# Altium project ESP32_DevBoard_B.PrjPcb
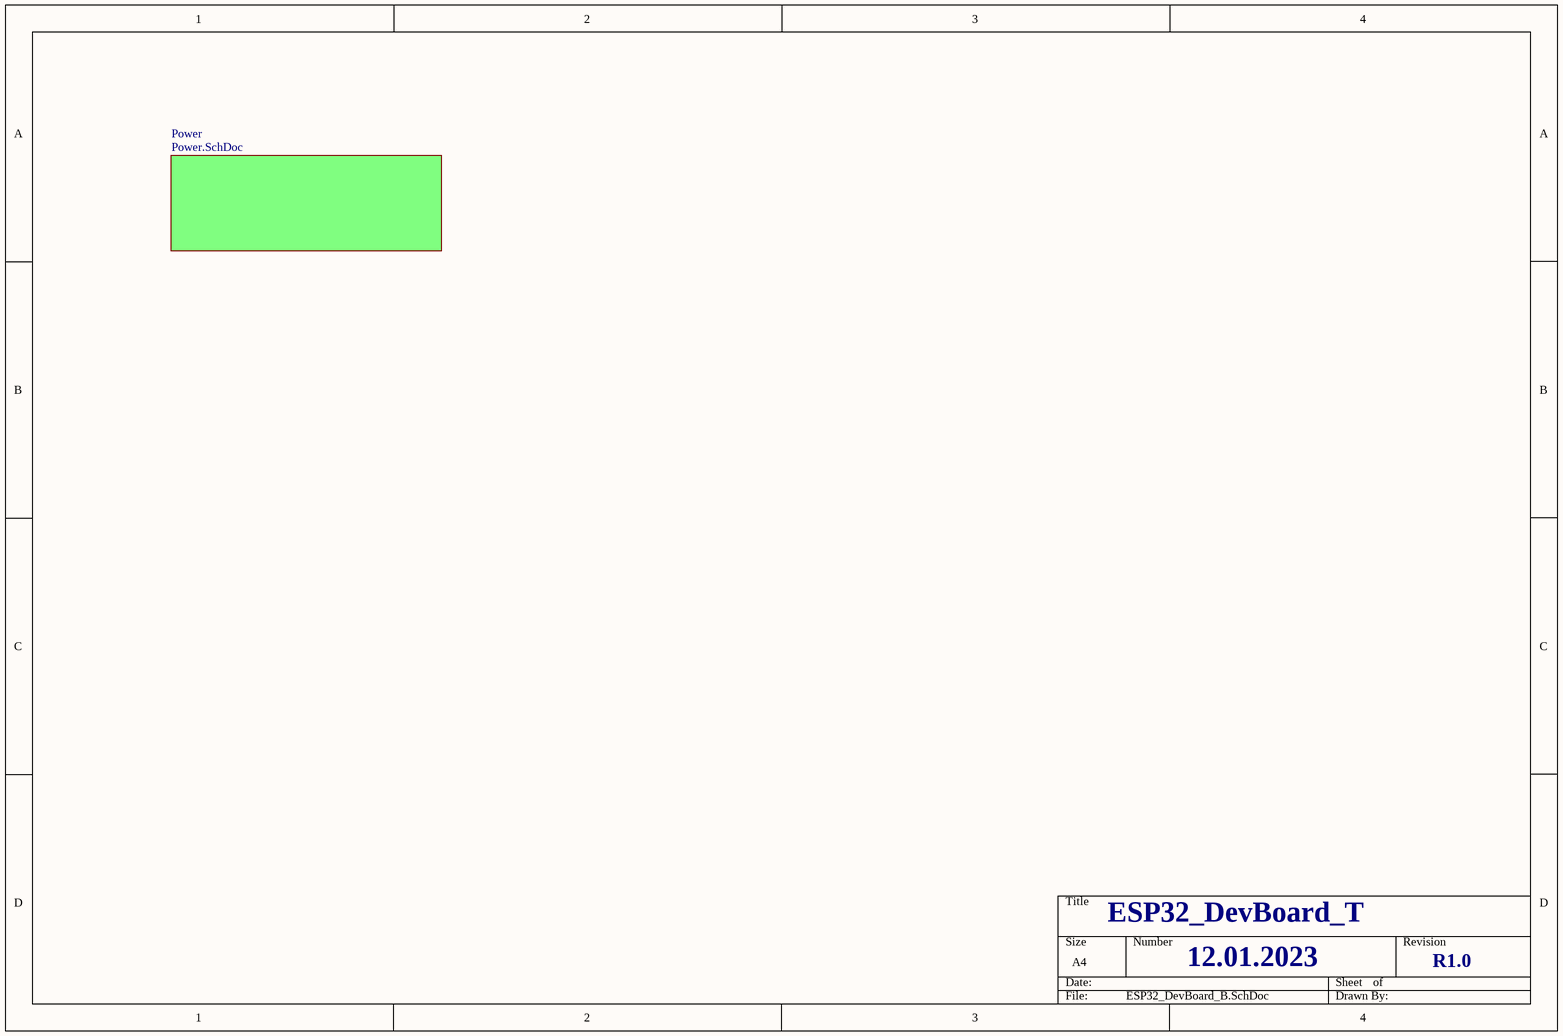
[diagram p0: ESP32_DevBoard_B.SchDoc]
5 sheets, 33 parts. Net scope: flat (ports and power ports of the same name join across sheets).
Board file: ESP32_DevBoard_B.PcbDoc
Sheets:
  ESP32_DevBoard_B.SchDoc
    Power = Power.SchDoc
  Output_Digital.SchDoc
  Connector.SchDoc
  Input_Digital.SchDoc

## Sheet ESP32_DevBoard_B.SchDoc
size A4

### Sub-sheets
Power = Power.SchDoc: no entries

### Notes on the sheet
- ESP32_DevBoard_T
- 12.01.2023
- R1.0

## Sheet Power.SchDoc
size A4
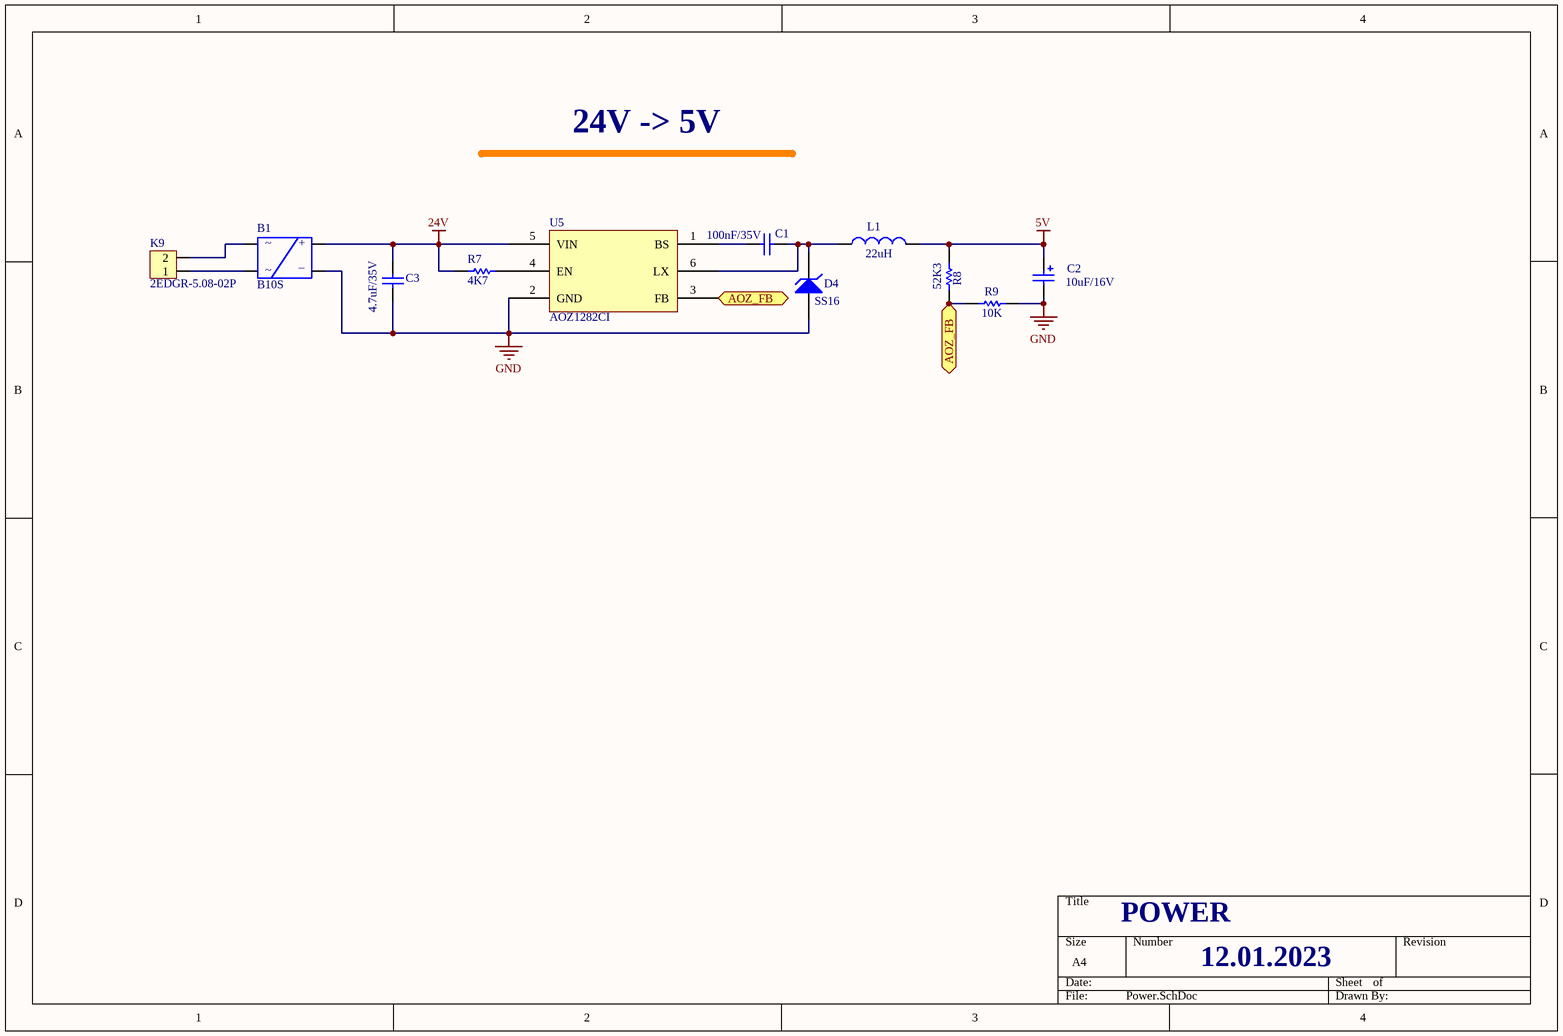
[diagram p1: Power.SchDoc]

### Parts
B1  B10S  [B10S]
C1  100nF/35V  [CAP0603W]
C2  10uF/16V  [CAP A]
C3  4.7uF/35V  [CAP1206W]
D4  SS16  [DO214AC]
K9  2EDGR-5.08-02P  [CON_DG129_02P]
L1  22uH  [INDUCTOR C43]
R7  4K7  [RES1608[0603]]
R8  52K3  [RES1608[0603]]
R9  10K  [RES1608[0603]]
U5  AOZ1282CI  [SOT23-6]

### Ports
AOZ_FB

### Nets
5V: C2.1 L1.2 R8.1
24V: B1.3 C3.1 R7.2 U5.5(VIN)
GND: B1.4 C2.2 C3.2 D4.1(A) R9.1 U5.2(GND)
NetB1_1: B1.1 K9.2
NetB1_2: B1.2 K9.1
NetC1_1: C1.1 U5.1(BS)
NetC1_2: C1.2 D4.2(K) L1.1 U5.6(LX)
NetR7_1: R7.1 U5.4(EN)
NetR8_2: R8.2 R9.2 U5.3(FB) ; port AOZ_FB

### Notes on the sheet
- 24V -> 5V
- POWER
- 12.01.2023
- (in symbol BRIDGE RECTIFIER) ~; +; _

### Library data of the parts
B1 = BRIDGE RECTIFIER: DIODE B10S MIC SMD; RB156: RB156
C1 = CAP1: CAPACITOR 0603 Case; Value: 100nF; Published: 8-Jun-2000; LatestRevisionDate: 17-Jul-2002; LatestRevisionNote: Re-released for DXP Platform.; PackageReference: C1206; Publisher: Altium Limited
C2 = CAP2: CAPACITOR Polarized Capacitor; Value: 100uF; Published: 8-Jun-2000; LatestRevisionDate: 17-Jul-2002; LatestRevisionNote: Re-released for DXP Platform.; PackageReference: RB7.6-15; Publisher: Altium Limited
C3 = CAP1: CAPACITOR 1206Case; Value: 100nF; Published: 8-Jun-2000; LatestRevisionDate: 17-Jul-2002; LatestRevisionNote: Re-released for DXP Platform.; PackageReference: C1206; Publisher: Altium Limited
D4 = DIODE: DIODE SCHOTTKY SS16 1A 60V DO214AC SMA; Published: 8-Jun-2000; LatestRevisionDate: 17-Jul-2002; LatestRevisionNote: Re-released for DXP Platform.; PackageReference: DIODE-0.7; Publisher: Altium Limited
K9 = KLEMENS_2P: CONNECTOR 5.08mm 2PIN 90DEG
L1 = INDUCTOR: INDUCTOR 22uH SDR43-220M-LF SMD 4.5X4X3.2MM; Code_IEC: 1005; Published: 8-Jun-2000; LatestRevisionDate: 17-Jul-2002; LatestRevisionNote: Re-released for DXP Platform.; PackageReference: 0402-A; Publisher: Altium Limited; Code_JEITA: 0402
R7-R9 = RES: RESISTOR 0603 Case %1; Value: 430R; Published: 8-Jun-2000; LatestRevisionDate: 17-Jul-2002; LatestRevisionNote: Re-released for DXP Platform.; PackageReference: AXIAL-0.5; Publisher: Altium Limited
U5 = AOZ1282CI: REGULATOR IC-1282 REG BUCK ADJ 1.2A SOT23-6

## Sheet Output_Digital.SchDoc
size A4
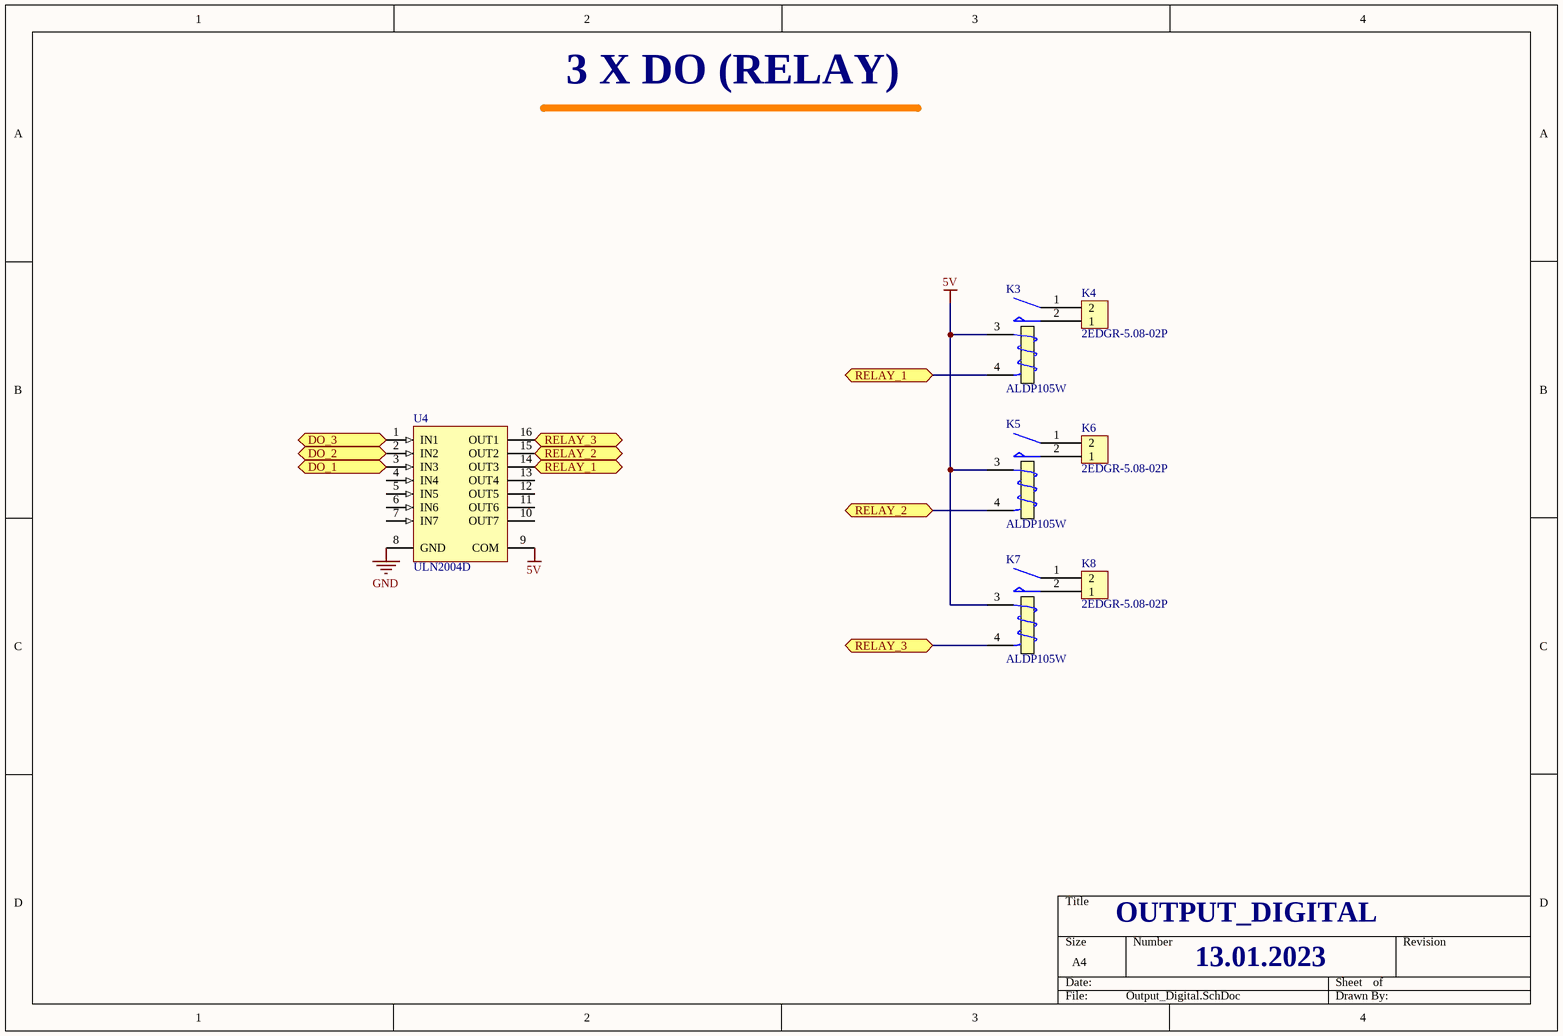
[diagram p2: Output_Digital.SchDoc]

### Parts
K3  ALDP105W  [RELAY_ALDP124W]
K4  2EDGR-5.08-02P  [CON_DG129_02P]
K5  ALDP105W  [RELAY_ALDP124W]
K6  2EDGR-5.08-02P  [CON_DG129_02P]
K7  ALDP105W  [RELAY_ALDP124W]
K8  2EDGR-5.08-02P  [CON_DG129_02P]
U4  ULN2004D  [SO16_M]

### Ports
DO_1, DO_2, DO_3, RELAY_1, RELAY_2, RELAY_3

### Nets
5V: K3.3(T1) K5.3(T1) K7.3(T1) U4.9(COM)
GND: U4.8(GND)
NetK3_1: K3.1(COM) K4.2
NetK3_2: K3.2(NO) K4.1
NetK3_4: K3.4(T2) U4.14(OUT3) ; port RELAY_1
NetK5_1: K5.1(COM) K6.2
NetK5_2: K5.2(NO) K6.1
NetK5_4: K5.4(T2) U4.15(OUT2) ; port RELAY_2
NetK7_1: K7.1(COM) K8.2
NetK7_2: K7.2(NO) K8.1
NetK7_4: K7.4(T2) U4.16(OUT1) ; port RELAY_3
NetP1_7: U4.2(IN2) ; port DO_2
NetP1_8: U4.3(IN3) ; port DO_1
NetP1_10: U4.1(IN1) ; port DO_3

Not connected (* = marked no-connect by the designer): U4 4(IN4) 5(IN5) 6(IN6) 7(IN7) 10(OUT7) 11(OUT6) 12(OUT5) 13(OUT4)

### Notes on the sheet
- 3 X DO (RELAY)
- OUTPUT_DIGITAL
- 13.01.2023

### Library data of the parts
K3 K5 K7 = RELAY_ALDP124W: RELAY PANASONIC ALDP105W 5A; Published: 8-Jun-2000; LatestRevisionDate: 17-Jul-2002; LatestRevisionNote: Re-released for DXP Platform.; PackageReference: MODULE5B; Publisher: Altium Limited
K4 K6 K8 = KLEMENS_2P: CONNECTOR 5.08mm 2PIN 90DEG
U4 = ULN2004D: IC Seven Darlington Array Integrated suppression diodes for inductive  loads; Published: 8-Jun-2000; LatestRevisionDate: 13-Apr-2006; LatestRevisionNote: IPC-7351 Footprint Added.; DatasheetVersion: Sep-1998; PackageVersion: May-1998; PackageReference: SO16; Publisher: Altium Limited; PackageDescription: 16-Pin Small Outline Integrated Circuit 1.27 mm Pitch; Code_IPC: SOIC127P600-16; ComponentLink1Description: Manufacturer Link; ComponentLink1URL: http://www.st.com/; ComponentLink2Description: Datasheet; ComponentLink2URL: http://www.st.com/stonline/products/literature/ds/5279/uln2001.pdf

## Sheet Connector.SchDoc
size A4
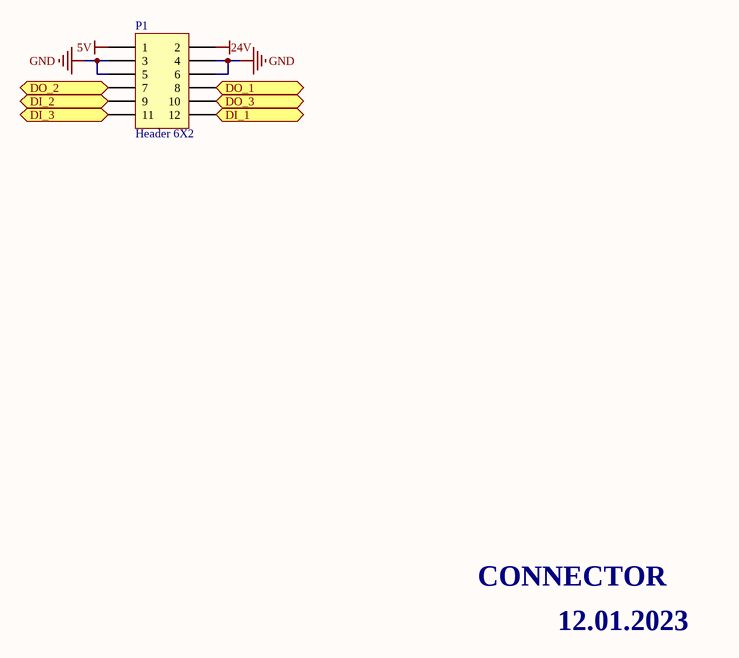
[diagram p3: Connector.SchDoc]

### Parts
P1  Header 6X2  [HDR2X6]

### Ports
DI_1, DI_2, DI_3, DO_1, DO_2, DO_3

### Nets
5V: P1.1
24V: P1.2
GND: P1.3 P1.4 P1.5 P1.6
NetP1_7: P1.7 ; port DO_2
NetP1_8: P1.8 ; port DO_1
NetP1_9: P1.9 ; port DI_2
NetP1_10: P1.10 ; port DO_3
NetP1_11: P1.11 ; port DI_3
NetP1_12: P1.12 ; port DI_1

### Notes on the sheet
- CONNECTOR
- 12.01.2023

### Library data of the parts
P1 = Header 6X2: CONNECTOR Header, 6-Pin, Dual row; LatestRevisionDate: 17-Jul-2002; LatestRevisionNote: Re-released for DXP Platform.; Publisher: Altium Limited

## Sheet Input_Digital.SchDoc
size A4
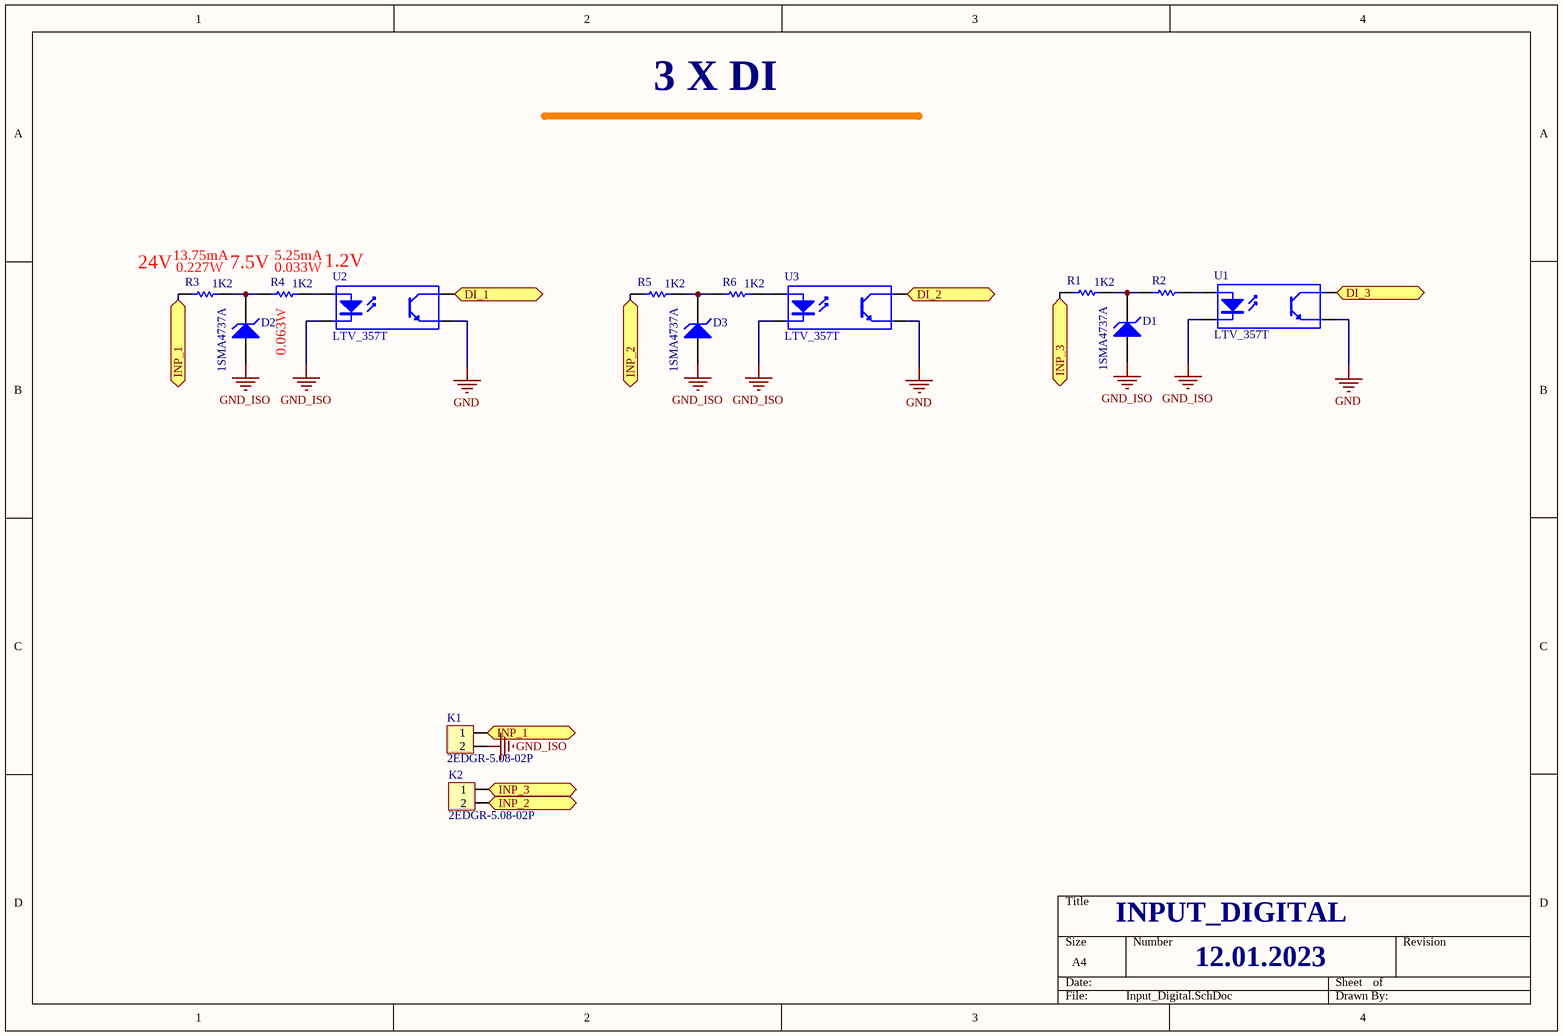
[diagram p4: Input_Digital.SchDoc]

### Parts
D1  1SMA4737A  [DO214AC]
D2  1SMA4737A  [DO214AC]
D3  1SMA4737A  [DO214AC]
K1  2EDGR-5.08-02P  [CON_DG129_02P]
K2  2EDGR-5.08-02P  [CON_DG129_02P]
R1  1K2  [RES3216[1206]]
R2  1K2  [RES2012[0805]]  (value not drawn)
R3  1K2  [RES3216[1206]]
R4  1K2  [RES2012[0805]]
R5  1K2  [RES3216[1206]]
R6  1K2  [RES2012[0805]]
U1  LTV_357T  [SMD-4]
U2  LTV_357T  [SMD-4]
U3  LTV_357T  [SMD-4]

### Ports
DI_1, DI_2, DI_3, INP_1, INP_2, INP_3

### Nets
GND: U1.3(E) U2.3(E) U3.3(E)
GND_ISO: D1.1(A) D2.1(A) D3.1(A) K1.2 U1.2(K) U2.2(K) U3.2(K)
NetD1_2: D1.2(K) R1.1 R2.2
NetD2_2: D2.2(K) R3.1 R4.2
NetD3_2: D3.2(K) R5.1 R6.2
NetK1_1: K1.1 R3.2 ; port INP_1
NetK2_1: K2.1 R1.2 ; port INP_3
NetK2_2: K2.2 R5.2 ; port INP_2
NetP1_9: U3.4(C) ; port DI_2
NetP1_11: U1.4(C) ; port DI_3
NetP1_12: U2.4(C) ; port DI_1
NetR2_1: R2.1 U1.1(A)
NetR4_1: R4.1 U2.1(A)
NetR6_1: R6.1 U3.1(A)

### Notes on the sheet
- 3 X DI
- (near R3) 24V
- (near R3) 13.75mA
- (near R3) 0.227W
- 7.5V
- 5.25mA
- 0.033W
- 1.2V
- 0.063W
- INPUT_DIGITAL
- 12.01.2023

### Library data of the parts
D1-D3 = DIODE: DIODE Zener Diode 7.5V 1W DO214AC; Published: 8-Jun-2000; LatestRevisionDate: 17-Jul-2002; LatestRevisionNote: Re-released for DXP Platform.; PackageReference: DIODE-0.7; Publisher: Altium Limited
K1 K2 = KLEMENS_2P: CONNECTOR 5.08mm 2PIN 90DEG
R1 R3 R5 = RES: RESISTOR 1206 Case %1; Value: 430R; Published: 8-Jun-2000; LatestRevisionDate: 17-Jul-2002; LatestRevisionNote: Re-released for DXP Platform.; PackageReference: AXIAL-0.5; Publisher: Altium Limited
R2 R4 R6 = RES: RESISTOR 0805 Case %1; Value: 430R; Published: 8-Jun-2000; LatestRevisionDate: 17-Jul-2002; LatestRevisionNote: Re-released for DXP Platform.; PackageReference: AXIAL-0.5; Publisher: Altium Limited
U1-U3 = LVT_357T: OPTOCOUPLER Transistor Output Optocouplers Optocoupler Phototrans; Published: 24-Mar-1999; LatestRevisionDate: 04-Mar-2005; LatestRevisionNote: Sch pins 3 & 4 Swapped.; DatasheetDocument: Nov-2003; PackageReference: DIP-4; Publisher: Altium Limited

## Nets that join several sheets
5V: Power (C2.1 L1.2 R8.1), Output_Digital (K3.3 K5.3 K7.3 U4.9), Connector (P1.1)
24V: Power (B1.3 C3.1 R7.2 U5.5), Connector (P1.2)
GND: Power (6 pins), Output_Digital (U4.8), Connector (P1.3 P1.4 P1.5 P1.6), Input_Digital (U1.3 U2.3 U3.3)
NetP1_7: Output_Digital (U4.2), Connector (P1.7)
NetP1_8: Output_Digital (U4.3), Connector (P1.8)
NetP1_9: Connector (P1.9), Input_Digital (U3.4)
NetP1_10: Output_Digital (U4.1), Connector (P1.10)
NetP1_11: Connector (P1.11), Input_Digital (U1.4)
NetP1_12: Connector (P1.12), Input_Digital (U2.4)